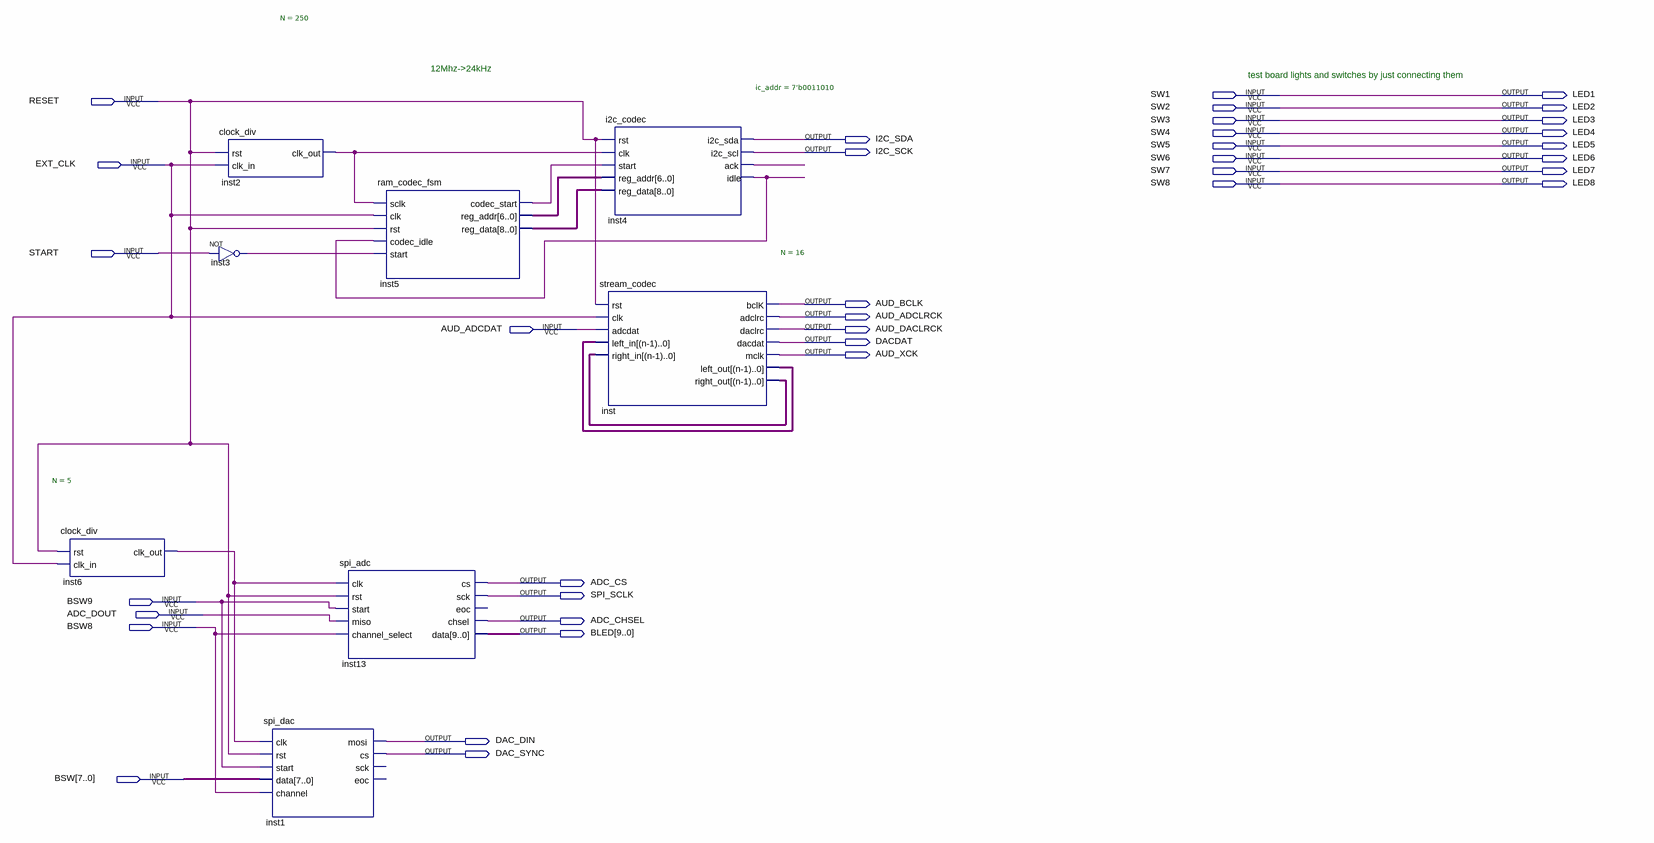
[diagram p0: schematic sheet]
// Quartus schematic testbench.bdf as structural Verilog: 8 symbols, 37 pins
module testbench (
  input  SW1,
  input  RESET,
  input  SW2,
  input  SW3,
  input  SW4,
  input  SW5,
  input  SW6,
  input  EXT_CLK,
  input  SW7,
  input  SW8,
  input  START,
  input  AUD_ADCDAT,
  input  BSW9,
  input  ADC_DOUT,
  input  BSW8,
  input  [7:0] BSW,
  output LED1,
  output LED2,
  output LED3,
  output LED4,
  output I2C_SDA,
  output LED5,
  output I2C_SCK,
  output LED6,
  output LED7,
  output LED8,
  output AUD_BCLK,
  output AUD_ADCLRCK,
  output AUD_DACLRCK,
  output DACDAT,
  output AUD_XCK,
  output ADC_CS,
  output SPI_SCLK,
  output ADC_CHSEL,
  output [9:0] BLED,
  output DAC_DIN,
  output DAC_SYNC
);

  wire inst2_clk_out, inst3_out, inst4_ack, inst4_idle, inst5_codec_start, inst6_clk_out;
  wire [6:0] inst5_reg_addr;
  wire [8:0] inst5_reg_data;
  wire [15:0] inst_left_out, inst_right_out;

  clock_div #(.N(5)) inst6 (.rst(RESET), .clk_in(EXT_CLK), .clk_out(inst6_clk_out));
  clock_div #(.N(250)) inst2 (.rst(RESET), .clk_in(EXT_CLK), .clk_out(inst2_clk_out));
  not inst3 (inst3_out, START);
  spi_dac inst1 (
    .clk(inst6_clk_out), .rst(RESET), .start(BSW9), .data(BSW), .channel(BSW8), .mosi(DAC_DIN), .cs(DAC_SYNC));  // open: sck, eoc
  spi_adc inst13 (
    .clk(inst6_clk_out), .rst(RESET), .start(BSW9), .miso(ADC_DOUT), .channel_select(BSW8), .cs(ADC_CS),
    .sck(SPI_SCLK), .chsel(ADC_CHSEL), .data(BLED));  // open: eoc
  ram_codec_fsm inst5 (
    .sclk(inst2_clk_out), .clk(EXT_CLK), .rst(RESET), .codec_idle(inst4_idle), .start(inst3_out),
    .codec_start(inst5_codec_start), .reg_addr(inst5_reg_addr), .reg_data(inst5_reg_data));
  i2c_codec #(.ic_addr(7'b0011010)) inst4 (
    .rst(RESET), .clk(inst2_clk_out), .start(inst5_codec_start), .reg_addr(inst5_reg_addr),
    .reg_data(inst5_reg_data), .i2c_scl(I2C_SCK), .ack(inst4_ack), .idle(inst4_idle), .i2c_sda(I2C_SDA));
  stream_codec #(.N(16)) inst (
    .rst(RESET), .clk(EXT_CLK), .adcdat(AUD_ADCDAT), .left_in(inst_left_out), .right_in(inst_right_out),
    .bclK(AUD_BCLK), .adclrc(AUD_ADCLRCK), .daclrc(AUD_DACLRCK), .dacdat(DACDAT), .mclk(AUD_XCK),
    .left_out(inst_left_out), .right_out(inst_right_out));

  assign LED1 = SW1;
  assign LED2 = SW2;
  assign LED3 = SW3;
  assign LED4 = SW4;
  assign LED5 = SW5;
  assign LED6 = SW6;
  assign LED7 = SW7;
  assign LED8 = SW8;

  // Notes on the sheet:
  //   12Mhz->24kHz
  //   test board lights and switches by just connecting them
endmodule
